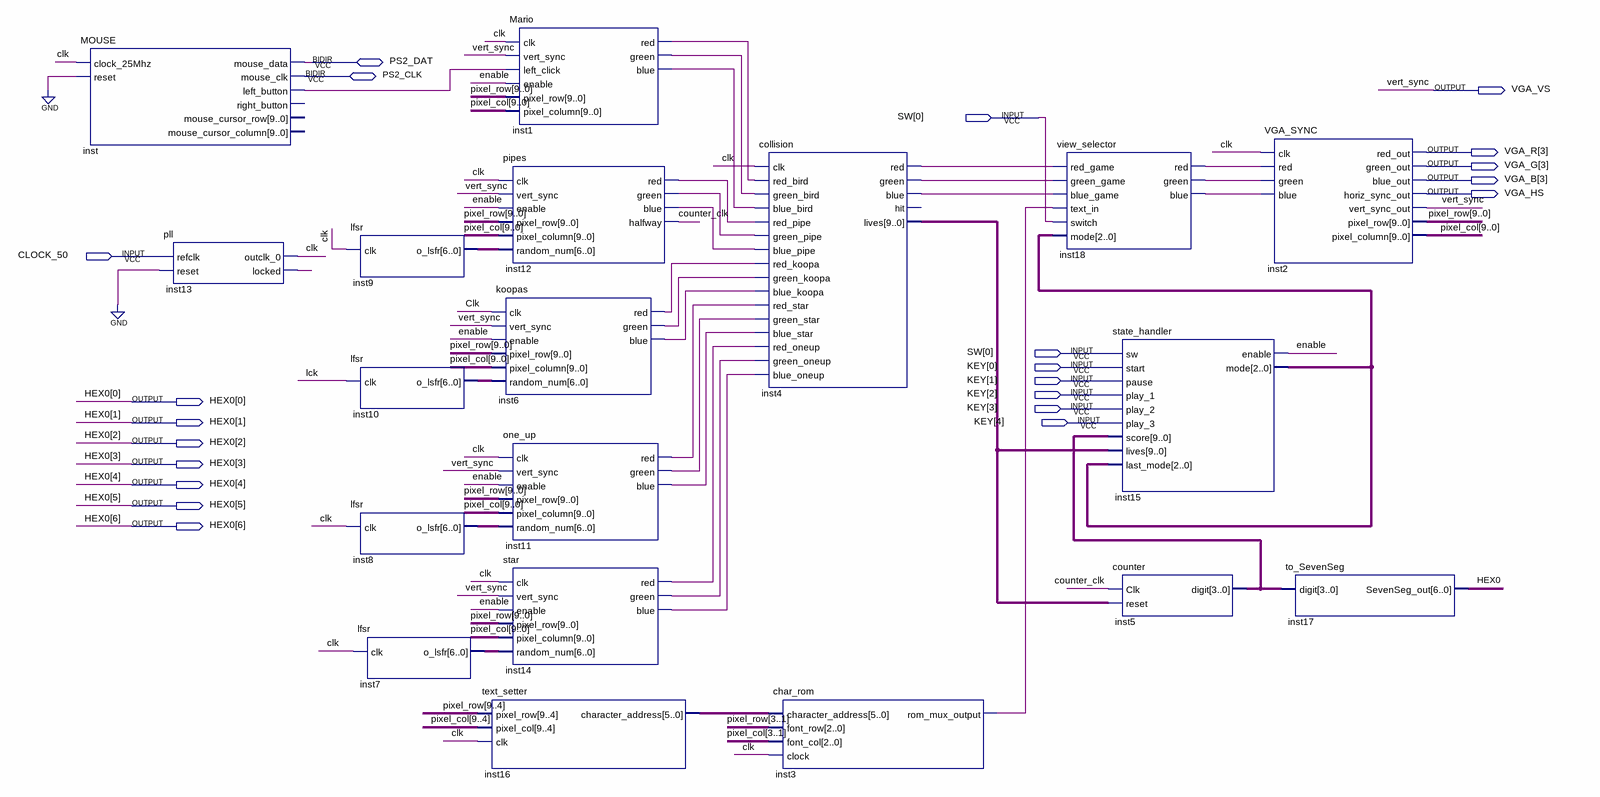
[diagram p0: schematic sheet]
// Quartus schematic Block1.bdf as structural Verilog: 19 symbols, 22 pins
module Block1 (
  input  [0:0] SW,
  input  CLOCK_50,
  input  [4:0] KEY,
  inout  PS2_DAT,
  inout  PS2_CLK,
  output VGA_VS,
  output [3:3] VGA_R,
  output [3:3] VGA_G,
  output [3:3] VGA_B,
  output VGA_HS,
  output [6:0] HEX0
);

  wire clk, counter_clk, enable, HEX0_1bit, inst1_blue, inst1_green, inst1_red, inst3_rom_mux_output,
       inst4_blue, inst4_green, inst4_red, inst6_blue, inst6_green, inst6_red, inst11_blue, inst11_green,
       inst11_red, inst12_blue, inst12_green, inst12_red, inst13_locked, inst14_blue, inst14_green,
       inst14_red, inst18_blue, inst18_green, inst18_red, inst_left_button, lck;
  wire [2:0] inst15_mode;
  wire [5:0] inst16_character_address;
  wire [6:0] inst7_o_lsfr, inst8_o_lsfr, inst9_o_lsfr, inst10_o_lsfr;
  wire [9:0] inst4_lives, inst5_digit, pixel_col, pixel_row;

  MOUSE inst (
    .clock_25Mhz(clk), .reset(1'b0), .left_button(inst_left_button), .mouse_data(PS2_DAT), .mouse_clk(PS2_CLK));  // open: right_button, mouse_cursor_row, mouse_cursor_column
  pll inst13 (.refclk(CLOCK_50), .reset(1'b0), .outclk_0(clk), .locked(inst13_locked));
  lfsr inst9 (.clk(clk), .o_lsfr(inst9_o_lsfr));
  lfsr inst10 (.clk(lck), .o_lsfr(inst10_o_lsfr));
  lfsr inst8 (.clk(clk), .o_lsfr(inst8_o_lsfr));
  lfsr inst7 (.clk(clk), .o_lsfr(inst7_o_lsfr));
  pipes inst12 (
    .clk(clk), .vert_sync(VGA_VS), .enable(enable), .pixel_row(pixel_row), .pixel_column(pixel_col),
    .random_num(inst9_o_lsfr), .red(inst12_red), .green(inst12_green), .blue(inst12_blue),
    .halfway(counter_clk));
  koopas inst6 (
    .clk(clk), .vert_sync(VGA_VS), .enable(enable), .pixel_row(pixel_row), .pixel_column(pixel_col),
    .random_num(inst10_o_lsfr), .red(inst6_red), .green(inst6_green), .blue(inst6_blue));
  one_up inst11 (
    .clk(clk), .vert_sync(VGA_VS), .enable(enable), .pixel_row(pixel_row), .pixel_column(pixel_col),
    .random_num(inst8_o_lsfr), .red(inst11_red), .green(inst11_green), .blue(inst11_blue));
  star inst14 (
    .clk(clk), .vert_sync(VGA_VS), .enable(enable), .pixel_row(pixel_row), .pixel_column(pixel_col),
    .random_num(inst7_o_lsfr), .red(inst14_red), .green(inst14_green), .blue(inst14_blue));
  text_setter inst16 (
    .pixel_row(pixel_row[9:4]), .pixel_col(pixel_col[9:4]), .clk(clk),
    .character_address(inst16_character_address));
  Mario inst1 (
    .clk(clk), .vert_sync(VGA_VS), .left_click(inst_left_button), .enable(enable), .pixel_row(pixel_row),
    .pixel_column(pixel_col), .red(inst1_red), .green(inst1_green), .blue(inst1_blue));
  collision inst4 (
    .clk(clk), .red_bird(inst1_red), .green_bird(inst1_green), .blue_bird(inst1_blue), .red_pipe(inst12_red),
    .green_pipe(inst12_green), .blue_pipe(inst12_blue), .red_koopa(inst6_red), .green_koopa(inst6_green),
    .blue_koopa(inst6_blue), .red_star(inst11_red), .green_star(inst11_green), .blue_star(inst11_blue),
    .red_oneup(inst14_red), .green_oneup(inst14_green), .blue_oneup(inst14_blue), .red(inst4_red),
    .green(inst4_green), .blue(inst4_blue), .lives(inst4_lives));  // open: hit
  char_rom inst3 (
    .character_address(inst16_character_address), .font_row(pixel_row[3:1]), .font_col(pixel_col[3:1]),
    .clock(clk), .rom_mux_output(inst3_rom_mux_output));
  view_selector inst18 (
    .red_game(inst4_red), .green_game(inst4_green), .blue_game(inst4_blue), .text_in(inst3_rom_mux_output),
    .switch(SW[0]), .mode(inst15_mode), .red(inst18_red), .green(inst18_green), .blue(inst18_blue));
  state_handler inst15 (
    .sw(SW[0]), .start(KEY[0]), .pause(KEY[1]), .play_1(KEY[2]), .play_2(KEY[3]), .score(inst5_digit),
    .lives(inst4_lives), .last_mode(inst15_mode), .enable(enable), .mode(inst15_mode));  // open: play_3
  counter inst5 (.Clk(counter_clk), .reset(inst4_lives), .digit(inst5_digit));
  VGA_SYNC inst2 (
    .clk(clk), .red(inst18_red), .green(inst18_green), .blue(inst18_blue), .red_out(VGA_R[3]),
    .green_out(VGA_G[3]), .blue_out(VGA_B[3]), .horiz_sync_out(VGA_HS), .vert_sync_out(VGA_VS),
    .pixel_row(pixel_row), .pixel_column(pixel_col));
  to_SevenSeg inst17 (.digit(inst5_digit), .SevenSeg_out(HEX0_1bit));

  // Other names for the same wires on the sheet: vert_sync = VGA_VS
endmodule
